# Altium schematic sheet AB_Amplifier.SchDoc
size A4; SheetNumber: 2; SheetTotal: 2
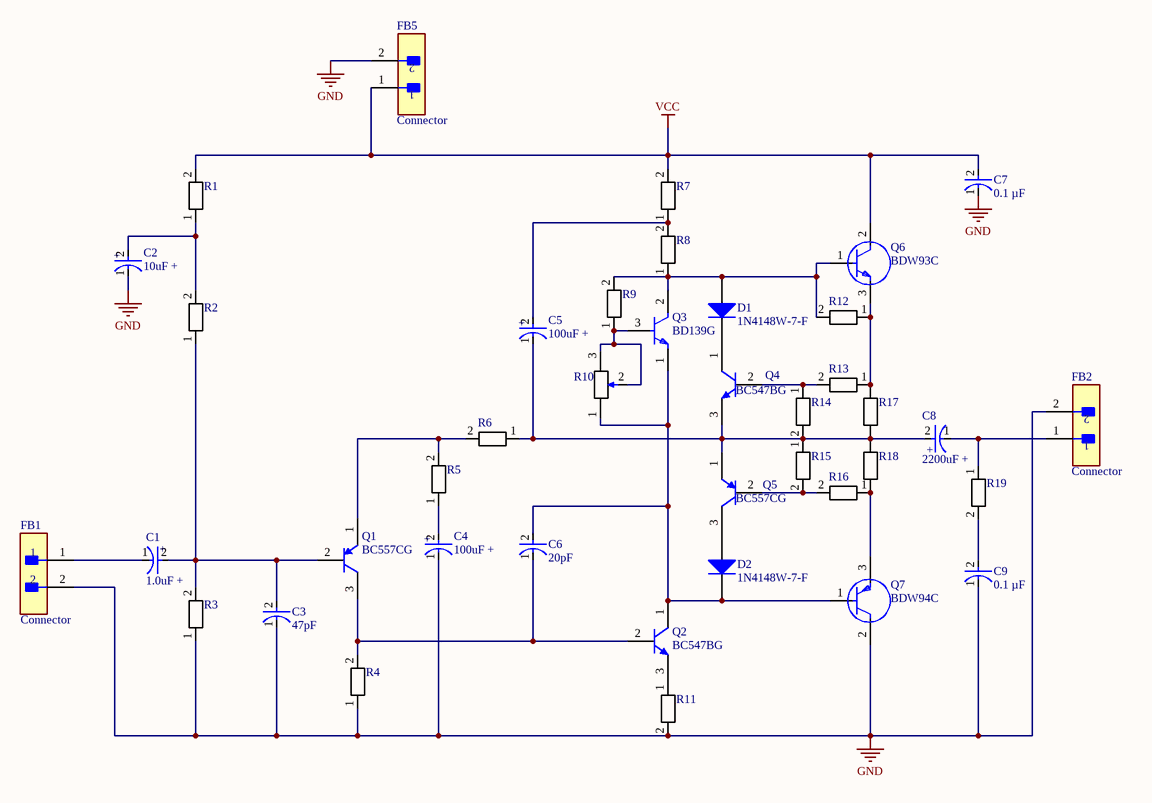
[diagram p0: AB_Amplifier.SchDoc]

## Parts
C1  1.0uF +  [106CKR050M]
C2  10uF +  [106CKR050M]
C3  47pF  [0805]
C4  100uF +  [107CKR050M]
C5  100uF +  [107CKR050M]
C6  20pF  [0805]
C7  0.1 µF  [0805]
C8  2200uF +  [2200cap]
C9  0.1 µF  [0805]
D1  1N4148W-7-F  [1N4148]
D2  1N4148W-7-F  [1N4148]
FB1  Connector  [Connector]
FB2  Connector  [Connector]
FB5  Connector  [Connector]
Q1  BC557CG  [BC557]
Q2  BC547BG  [BC547]
Q3  BD139G  [BD139]
Q4  BC547BG  [BC547]
Q5  BC557CG  [BC557]
Q6  BDW93C  [BDW94C]
Q7  BDW94C  [BDW94C]
R1  CRCW080510R0FKEA  [0805]  (value not drawn)
R2  CRCW080510R0FKEA  [0805]  (value not drawn)
R3  CRCW080510R0FKEA  [0805]  (value not drawn)
R4  CRCW080510R0FKEA  [0805]  (value not drawn)
R5  CRCW080510R0FKEA  [0805]  (value not drawn)
R6  CRCW080510R0FKEA  [0805]  (value not drawn)
R7  CRCW080510R0FKEA  [0805]  (value not drawn)
R8  CRCW080510R0FKEA  [0805]  (value not drawn)
R9  CRCW080510R0FKEA  [0805]  (value not drawn)
R10  249FGJSPXB25503KA  [Potentiometer 15mm]  (value not drawn)
R11  CRCW080510R0FKEA  [0805]  (value not drawn)
R12  CRCW080510R0FKEA  [0805]  (value not drawn)
R13  CRCW080510R0FKEA  [0805]  (value not drawn)
R14  CRCW080510R0FKEA  [0805]  (value not drawn)
R15  CRCW080510R0FKEA  [0805]  (value not drawn)
R16  CRCW080510R0FKEA  [0805]  (value not drawn)
R17  RK73B2ATTD224J  [0.33 1W]  (value not drawn)
R18  RK73B2ATTD224J  [0.33 1W]  (value not drawn)
R19  CRCW080510R0FKEA  [0805]  (value not drawn)

## Nets
GND: C2.1(C) C3.1(C) C4.1(C) C7.1(C) C9.1(C) FB1.2 FB2.2 FB5.2 Q7.2(C) R3.1 R4.1 R11.2
VCC: C7.2(A) FB5.1 Q6.2(C) R1.2 R7.2
NetC1_1: C1.1(C) FB1.1
NetC1_2: C1.2(A) C3.2(A) Q1.2(B) R2.1 R3.2
NetC2_2: C2.2(A) R1.1 R2.2
NetC4_2: C4.2(A) R5.1
NetC5_1: C5.1(C) C8.2(A) Q4.3(E) Q5.1(E) R6.1 R14.2 R15.1 R17.1 R18.2
NetC5_2: C5.2(A) R7.1 R8.2
NetC6_1: C6.1(C) Q1.3(E) Q2.2(B) R4.2
NetC6_2: C6.2(A) D2.2(K) Q2.1(C) Q3.1(E) Q7.1(B) R10.1
NetC8_1: C8.1(C) FB2.1 R19.1
NetC9_2: C9.2(A) R19.2
NetD1_1: D1.1(A) Q3.2(C) Q6.1(B) R8.1 R9.2 R12.2
NetD1_2: D1.2(K) Q4.1(C)
NetD2_1: D2.1(A) Q5.3(C)
NetQ1_1: Q1.1(C) R5.2 R6.2
NetQ2_3: Q2.3(E) R11.1
NetQ3_3: Q3.3(B) R9.1 R10.2 R10.3
NetQ4_2: Q4.2(B) R13.2 R14.1
NetQ5_2: Q5.2(B) R15.2 R16.2
NetQ6_3: Q6.3(E) R12.1 R13.1 R17.2
NetQ7_3: Q7.3(E) R16.1 R18.1

## Notes on the sheet
- (in symbol Elco - 1.0uF) +
- (in symbol Elco - 10uF) +
- (in symbol Elco - 100uF) +
- (in symbol Elco - 2000uF) +

## Library data of the parts
C1 = Elco - 1.0uF
C2 = Elco - 10uF
C3 C6 C7 C9 = Capasitor - 0805
C4 C5 = Elco - 100uF
C8 = Elco - 2000uF
D1 D2 = Diode - 1N4148: Fast Switching Diode, 100 V, 0.15 A, -65 to 150 degC, 2-Pin?SOD123, RoHS, Tape and Reel; Recovery Time: 4ns; Brand: DiodesIncorporated; Unit Weight: 0.000353oz; Max Surge Current: 2A; Peak Reverse Voltage: 100V; Ir - Reverse Current: 1uA; Vf - Forward Voltage: 1.25V; Configuration: Single; If - Forward Current: 0.15A; Product Category: Diodes-GeneralPurpose,Power,Switching; Operating Temperature Range: -65Cto+150C; Packaging: Reel; Manufacturer URL: http://www.diodes.com/; Maximum Operating Temperature: +150C; Height: 1.25mm; Minimum Operating Temperature: -65C; Product: SwitchingDiodes; Package URL: http://www.diodes.com/datasheets/ds18004.pdf; Type: SwitchingDiode; Package Reference: SOD123-2; Width: 1.7mm; Datasheet URL: http://www.farnell.com/datasheets/1915529.pdf; Datasheet Version: Rev. 24-2, 10/2013; Series: 1N4148; Factory Pack Quantity: 3000; Length: 2.85mm; RoHS: True; Manufacturer: DiodesIncorporated; Mounting Style: SMD/SMT; Package / Case: SOD-123
FB1 FB2 FB5 = Connector: Ferrite Bead; Manufacturer_Name: ABRACON; Manufacturer_Part_Number: ACML-0805-500-T; Datasheet Link: https://abracon.com/Magnetics/new/ACML-0805.pdf; Height: 1.05mm; Mouser Part Number: 815-ACML-0805-500T; Mouser Price/Stock: https://www.mouser.co.uk/ProductDetail/ABRACON/ACML-0805-500-T?qs=qw2lGDycG5tBjukxHQX6NA%3D%3D; Arrow Part Number: ACML-0805-500-T; Arrow Price/Stock: https://www.arrow.com/en/products/acml-0805-500-t/abracon
Q1 = Transistor - BC557_1: Amplifier Transistor, PNP Silicon, 3-Pin TO-92, Pb-Free, Bulk Box; Manufacturer: On Semiconductor; IC Continuous (A): -0.1; RoHS: TRUE; DatasheetVersion: Rev. 3; ComponentLink2Description: Datasheet; Packing: Bulk Box; PackageReference: TO-92-3-29-11_AM_SL; ComponentLink3URL: http://www.onsemi.cn/pub_link/Collateral/2N6426-D.PDF; ComponentLink2URL: http://www.onsemi.com/pub_link/Collateral/BC556B-D.PDF; PartNumber: BC557CG; PackageDescription: 3-Pin Transistor Outline, Body 4.825 x 3.685 mm, Pitch 1.27 mm; PackageVersion: Rev. AM; ComponentLink3Description: Package Specification; ComponentLink1URL: http://www.onsemi.com/; ComponentLink1Description: Manufacturer URL; Polarity: PNP; Mounting Technology: Through Hole
Q2 = Transistor - BC547_1: Amplifier Transistor, NPN Silicon, 3-Pin TO-92, Pb-Free, Bulk Box; Manufacturer: On Semiconductor; IC Continuous (A): 0.1; fT Min (MHz): 150; Packing: Bulk Box; RoHS: TRUE; PackageVersion: Rev. AM; Mounting Technology: Through Hole; Polarity: NPN; PackageReference: TO-92-3-29-11_AM_SL; DatasheetVersion: Rev. 7; ComponentLink2URL: http://www.onsemi.com/pub_link/Collateral/BC546-D.PDF; ComponentLink1Description: Manufacturer URL; ComponentLink3URL: http://www.onsemi.cn/pub_link/Collateral/2N6426-D.PDF; PackageDescription: 3-Pin Transistor Outline, Body 4.825 x 3.685 mm, Pitch 1.27 mm; ComponentLink2Description: Datasheet; ComponentLink1URL: http://www.onsemi.com/; PartNumber: BC547BG; ComponentLink3Description: Package Specification
Q3 = Transistor - BD139: NexarPartId: 354669; Manufacturer Lifecycle Status: ACTIVE; Collector Emitter Saturation Voltage: 500mV; Collector Emitter Breakdown Voltage: 80V; hFE Min: 25; Element Configuration: Single; Max Power Dissipation: 1.25W; Max Junction Temperature (Tj): 150°C; Emitter Base Voltage (VEBO): 5V; Max Collector Current: 1.5A; Number of Elements: 1; Polarity: NPN; Min Operating Temperature: -55°C; Max Operating Temperature: 150°C; Voltage Rating (DC): 80V; REACH SVHC: No SVHC; Radiation Hardening: No; Contact Plating: Tin; Schedule B: 8541290080, 8541290080|8541290080, 8541290080|8541290080|8541290080, 8541290080|8541290080|8541290080|8541290080; Number of Pins: 3; Case/Package: TO-225; Lifecycle Status: Production; Collector Base Voltage (VCBO): 80V; Weight: 4.535924g; Height: 11.04mm; RoHS: Compliant; Width: 2.66mm; Collector Emitter Voltage (VCEO): 80V; Lead Free: Lead Free; Current Rating: 1.5A; Power Dissipation: 1.25W; Packaging: Bulk; Length: 7.74mm
Q4 = Transistor - BC547: Amplifier Transistor, NPN Silicon, 3-Pin TO-92, Pb-Free, Bulk Box; Manufacturer: On Semiconductor; IC Continuous (A): 0.1; fT Min (MHz): 150; Packing: Bulk Box; RoHS: TRUE; PackageVersion: Rev. AM; Mounting Technology: Through Hole; Polarity: NPN; PackageReference: TO-92-3-29-11_AM_SL; DatasheetVersion: Rev. 7; ComponentLink2URL: http://www.onsemi.com/pub_link/Collateral/BC546-D.PDF; ComponentLink1Description: Manufacturer URL; ComponentLink3URL: http://www.onsemi.cn/pub_link/Collateral/2N6426-D.PDF; PackageDescription: 3-Pin Transistor Outline, Body 4.825 x 3.685 mm, Pitch 1.27 mm; ComponentLink2Description: Datasheet; ComponentLink1URL: http://www.onsemi.com/; PartNumber: BC547BG; ComponentLink3Description: Package Specification
Q5 = Transistor - BC557: Amplifier Transistor, PNP Silicon, 3-Pin TO-92, Pb-Free, Bulk Box; Manufacturer: On Semiconductor; IC Continuous (A): -0.1; RoHS: TRUE; DatasheetVersion: Rev. 3; ComponentLink2Description: Datasheet; Packing: Bulk Box; PackageReference: TO-92-3-29-11_AM_SL; ComponentLink3URL: http://www.onsemi.cn/pub_link/Collateral/2N6426-D.PDF; ComponentLink2URL: http://www.onsemi.com/pub_link/Collateral/BC556B-D.PDF; PartNumber: BC557CG; PackageDescription: 3-Pin Transistor Outline, Body 4.825 x 3.685 mm, Pitch 1.27 mm; PackageVersion: Rev. AM; ComponentLink3Description: Package Specification; ComponentLink1URL: http://www.onsemi.com/; ComponentLink1Description: Manufacturer URL; Polarity: PNP; Mounting Technology: Through Hole
Q6 = Transistor - BDW93C: BDW93C BDW93C Series 100 V 12 A 80 W NPN Darlington Transistor - TO-220-3; Manufacturer Lifecycle Status: LAST SHIPMENTS; NexarPartId: 84324666; Collector Emitter Breakdown Voltage: 100V; Emitter Base Voltage (VEBO): 12V; Max Collector Current: 12A; Element Configuration: Single; hFE Min: 750; Number of Elements: 1; Max Power Dissipation: 80W; Collector Emitter Saturation Voltage: 2V; Max Junction Temperature (Tj): 150°C; Radiation Hardening: No; Number of Pins: 3; RoHS: Compliant; Collector Base Voltage (VCBO): 100V; Length: 10.1mm; Max Operating Temperature: 150°C; Min Operating Temperature: -65°C; Case/Package: TO-220-3; Schedule B: 8541290080, 8541290080|8541290080, 8541290080|8541290080|8541290080, 8541290080|8541290080|8541290080|8541290080; REACH SVHC: No SVHC; Width: 4.7mm; Lifecycle Status: EOL; Polarity: NPN; Collector Emitter Voltage (VCEO): 100V; Contact Plating: Tin; Lead Free: Lead Free; Weight: 1.8g; Voltage Rating (DC): 100V; Height: 9.4mm; Mount: Through Hole; Current Rating: 12A; Power Dissipation: 80W; Packaging: Bulk
Q7 = Transistor - BDW94C: Transistor BJT PNP; Manufacturer_Name: STMicroelectronics; Datasheet Link: http://www.st.com/web/en/resource/technical/document/datasheet/CD00000925.pdf; Height: 4.6mm; Manufacturer_Part_Number: BDW94C; Mouser Part Number: 511-BDW94C; Mouser Price/Stock: https://www.mouser.co.uk/ProductDetail/STMicroelectronics/BDW94C?qs=ljbEvF4DwOM3QQOPDay3pQ%3D%3D; Arrow Part Number: BDW94C; Arrow Price/Stock: https://www.arrow.com/en/products/bdw94c/stmicroelectronics?utm_currency=USD&region=nac
R1-R9 R11-R16 R19 = Resistor 0805: Manufacturer: Vishay Dale; Part Number: CRCW080510R0FKEA
R10 = Potentiometer: 249FGJSPXB25503KA Res Cermet POT 50K Ohm 20% 1W 1(Elec)/1(Mech)Turn 6.35mm Pin Panel Mount/Through Hole Bulk; NexarPartId: 42669055; Number of Turns: 1; Tolerance: 10%; Voltage Rating: 224V; Insulation Resistance: 1GΩ; Hole Diameter: 9.525mm; Resistance: 50kΩ; Temperature Coefficient: 100ppm/°C; RoHS: Compliant; Length: 12.7mm; Power Rating: 1W; Contact Plating: Tin; Min Operating Temperature: -55°C; Composition: Cermet, Potentiometer; Number of Gangs: 1; Max Operating Temperature: 125°C; Depth: 12.7mm; Termination: Pin; REACH SVHC: Unknown; Type: Potentiometer; Mount: Panel, Through Hole; Military Standard: Not; Height: 13.11mm; Width: 12.7mm
R17 R18 = Resistor - 1W Through Hole: Manufacturer: KOA Speer; Part Number: RK73B2ATTD224J